# Altium project DMM6500 Scan card.PrjPcb
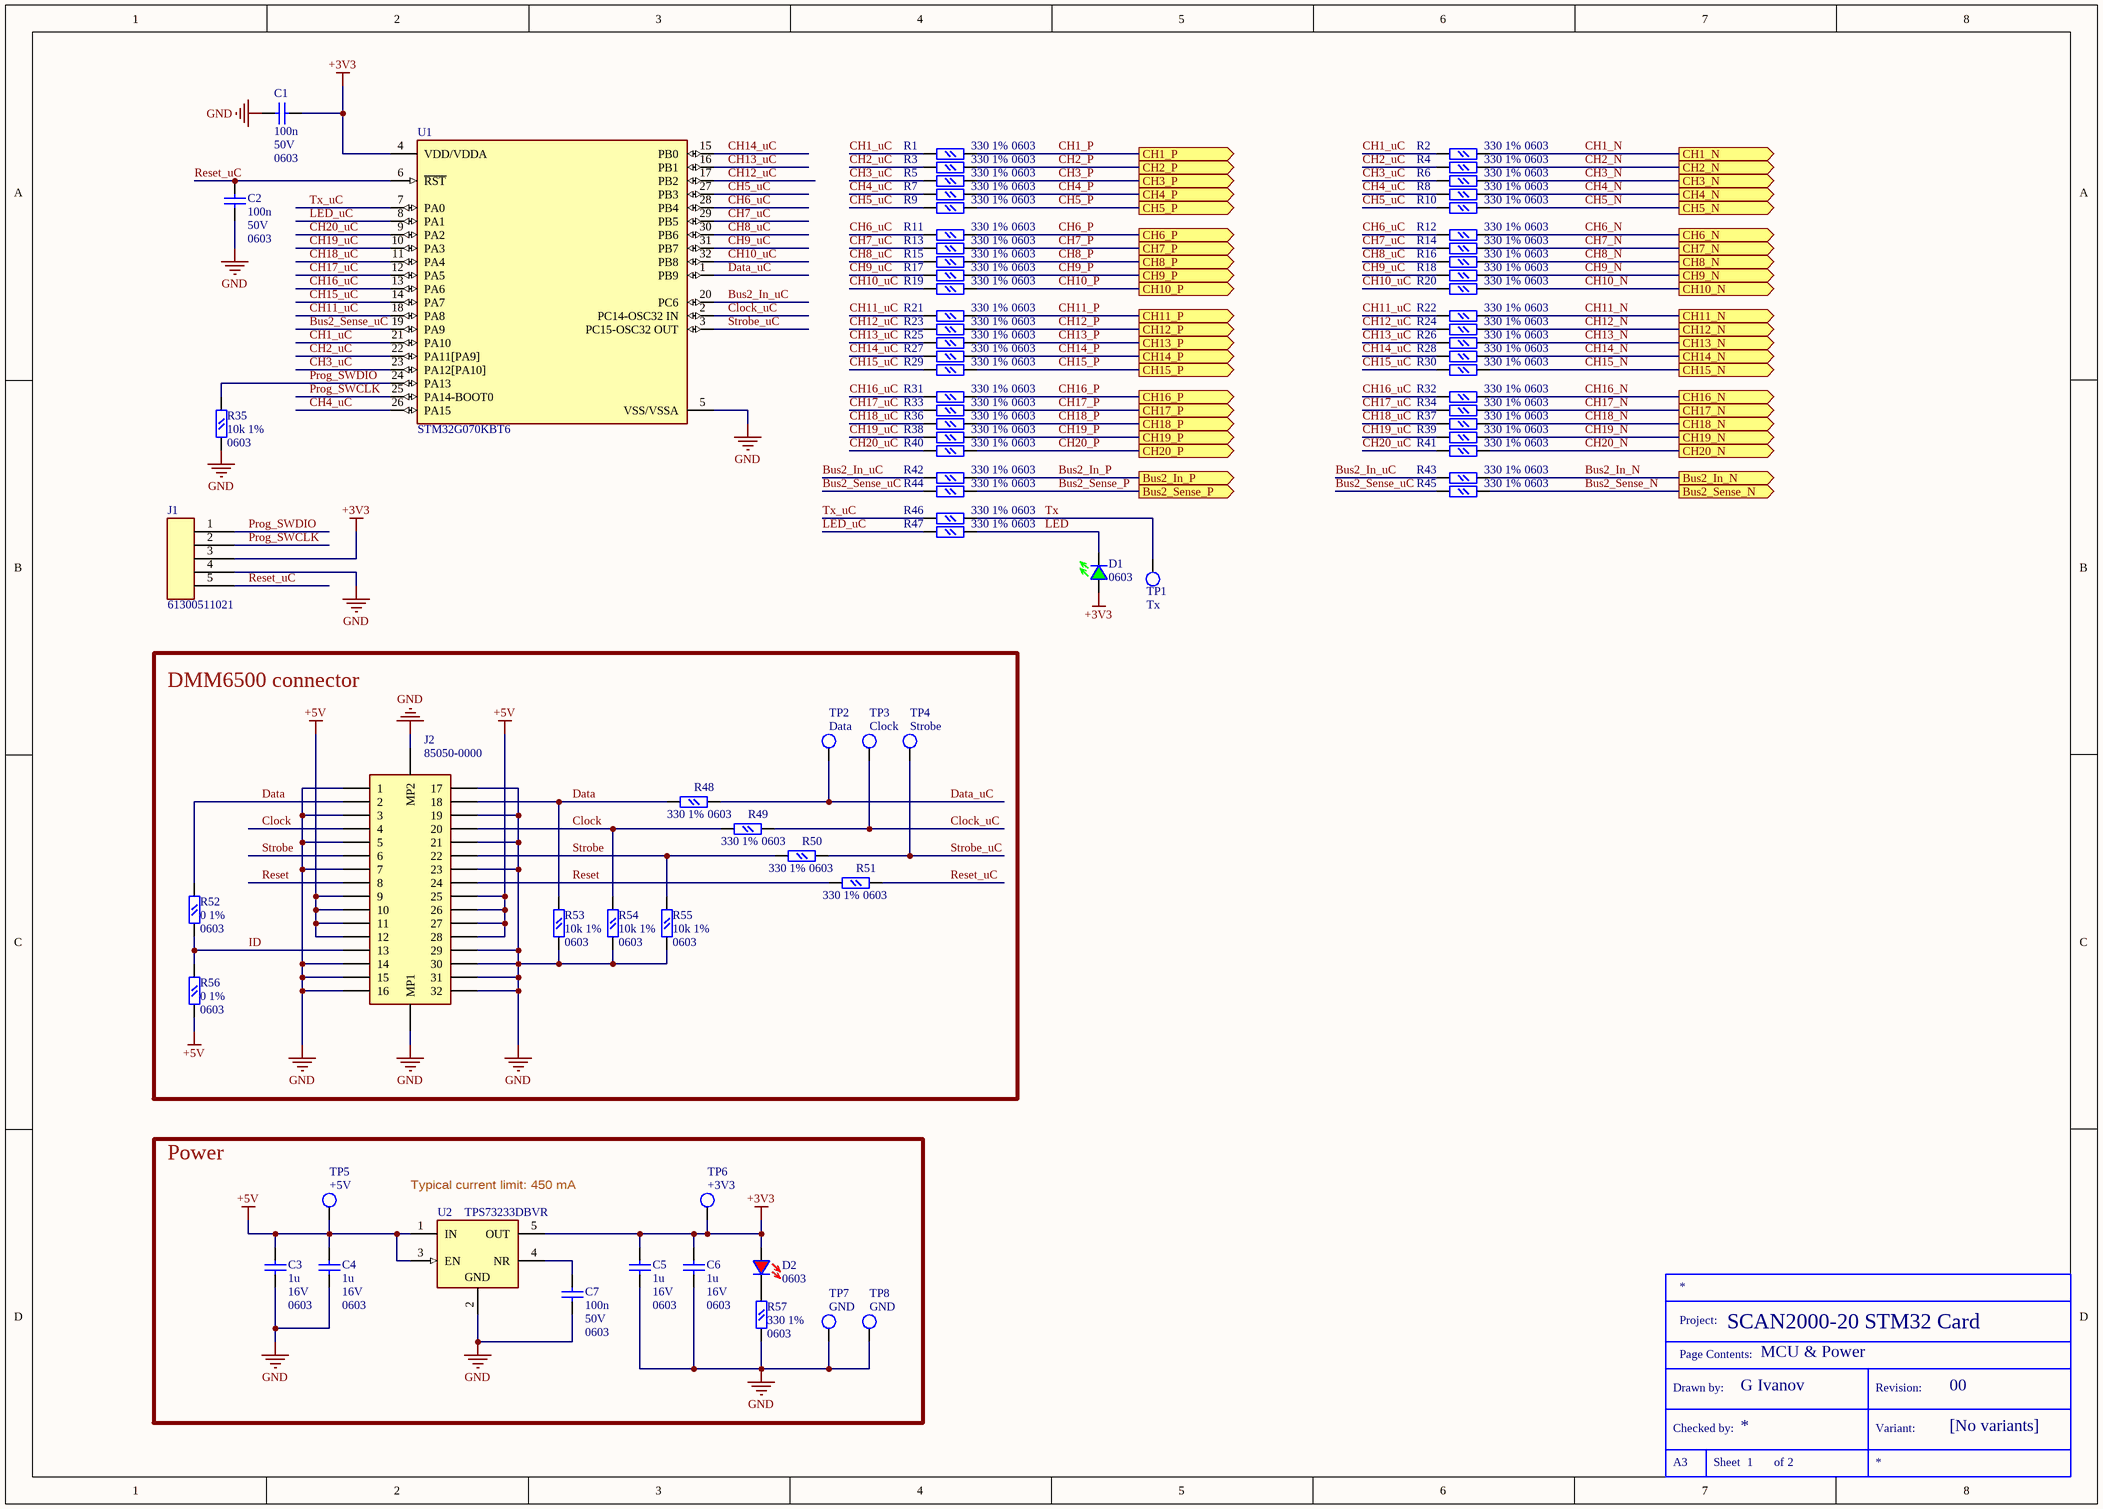
[diagram p0: Scan card MCU&Power.SchDoc]
2 sheets, 166 parts. Net scope: flat (ports and power ports of the same name join across sheets).
Board files: PCB1.PcbDoc, CAMtastic1.PcbDoc, DMM6500 Scan card.PcbDoc
Sheets:
  Scan card MCU&Power.SchDoc
  Scan card SSR.SchDoc

## Sheet Scan card MCU&Power.SchDoc: MCU & Power
size A3; DrawnBy: G Ivanov; Revision: 00; SheetNumber: 1; SheetTotal: 2; ProjectTitle: SCAN2000-20 STM32 Card; Variant: [No variants]; SheetSize: A3; SPICEModelCacheGEYJKKNZ: <root> / <DocumentId>GEYJKKNZ</DocumentId> / </root>

### Parts
(Parts that share a designator on the sheet are numbered #1, #2 ... from top to bottom, then left to right.)
C1  100n  Voltage: 50V  Package (imperial): 0603  [CAPC1608X08N]
C2  100n  Voltage: 50V  Package (imperial): 0603  [CAPC1608X08N]
C3  1u  Voltage: 16V  Package (imperial): 0603  [CAPC1608X08N]
C4  1u  Voltage: 16V  Package (imperial): 0603  [CAPC1608X08N]
C5  1u  Voltage: 16V  Package (imperial): 0603  [CAPC1608X08N]
C6  1u  Voltage: 16V  Package (imperial): 0603  [CAPC1608X08N]
C7  100n  Voltage: 50V  Package (imperial): 0603  [CAPC1608X08N]
D1  0603  [LED0603green]
D2  0603  [LED0603red]
J1  61300511021  [WE 61300511021]
J2  85050-0000  [Molex 85050-0000]
R1  330 1%  Package (imperial): 0603  [RESC1608X06N]
R2  330 1%  Package (imperial): 0603  [RESC1608X06N]
R3  330 1%  Package (imperial): 0603  [RESC1608X06N]
R4  330 1%  Package (imperial): 0603  [RESC1608X06N]
R5  330 1%  Package (imperial): 0603  [RESC1608X06N]
R6  330 1%  Package (imperial): 0603  [RESC1608X06N]
R7  330 1%  Package (imperial): 0603  [RESC1608X06N]
R8  330 1%  Package (imperial): 0603  [RESC1608X06N]
R9  330 1%  Package (imperial): 0603  [RESC1608X06N]
R10  330 1%  Package (imperial): 0603  [RESC1608X06N]
R11  330 1%  Package (imperial): 0603  [RESC1608X06N]
R12  330 1%  Package (imperial): 0603  [RESC1608X06N]
R13  330 1%  Package (imperial): 0603  [RESC1608X06N]
R14  330 1%  Package (imperial): 0603  [RESC1608X06N]
R15  330 1%  Package (imperial): 0603  [RESC1608X06N]
R16  330 1%  Package (imperial): 0603  [RESC1608X06N]
R17  330 1%  Package (imperial): 0603  [RESC1608X06N]
R18  330 1%  Package (imperial): 0603  [RESC1608X06N]
R19  330 1%  Package (imperial): 0603  [RESC1608X06N]
R20  330 1%  Package (imperial): 0603  [RESC1608X06N]
R21  330 1%  Package (imperial): 0603  [RESC1608X06N]
R22  330 1%  Package (imperial): 0603  [RESC1608X06N]
R23  330 1%  Package (imperial): 0603  [RESC1608X06N]
R24  330 1%  Package (imperial): 0603  [RESC1608X06N]
R25  330 1%  Package (imperial): 0603  [RESC1608X06N]
R26  330 1%  Package (imperial): 0603  [RESC1608X06N]
R27  330 1%  Package (imperial): 0603  [RESC1608X06N]
R28  330 1%  Package (imperial): 0603  [RESC1608X06N]
R29  330 1%  Package (imperial): 0603  [RESC1608X06N]
R30  330 1%  Package (imperial): 0603  [RESC1608X06N]
R31  330 1%  Package (imperial): 0603  [RESC1608X06N]
R32  330 1%  Package (imperial): 0603  [RESC1608X06N]
R33  330 1%  Package (imperial): 0603  [RESC1608X06N]
R34  330 1%  Package (imperial): 0603  [RESC1608X06N]
R35  10k 1%  Package (imperial): 0603  [RESC1608X06N]
R36  330 1%  Package (imperial): 0603  [RESC1608X06N]
R37  330 1%  Package (imperial): 0603  [RESC1608X06N]
R38  330 1%  Package (imperial): 0603  [RESC1608X06N]
R39  330 1%  Package (imperial): 0603  [RESC1608X06N]
R40  330 1%  Package (imperial): 0603  [RESC1608X06N]
R41  330 1%  Package (imperial): 0603  [RESC1608X06N]
R42  330 1%  Package (imperial): 0603  [RESC1608X06N]
R43  330 1%  Package (imperial): 0603  [RESC1608X06N]
R44  330 1%  Package (imperial): 0603  [RESC1608X06N]
R45  330 1%  Package (imperial): 0603  [RESC1608X06N]
R46  330 1%  Package (imperial): 0603  [RESC1608X06N]
R47  330 1%  Package (imperial): 0603  [RESC1608X06N]
R48  330 1%  Package (imperial): 0603  [RESC1608X06N]
R49  330 1%  Package (imperial): 0603  [RESC1608X06N]
R50  330 1%  Package (imperial): 0603  [RESC1608X06N]
R51  330 1%  Package (imperial): 0603  [RESC1608X06N]
R52  0 1%  Package (imperial): 0603  [RESC1608X06N]
R53  10k 1%  Package (imperial): 0603  [RESC1608X06N]
R54  10k 1%  Package (imperial): 0603  [RESC1608X06N]
R55  10k 1%  Package (imperial): 0603  [RESC1608X06N]
R56  0 1%  Package (imperial): 0603  [RESC1608X06N]
R57  330 1%  Package (imperial): 0603  [RESC1608X06N]
TBLOCK?#1  *  (value not drawn)  (graphical)
TP1  Tx  [TP_ROUND_20_10]
TP2  Data  [TP_ROUND_20_10]
TP3  Clock  [TP_ROUND_20_10]
TP4  Strobe  [TP_ROUND_20_10]
TP5  +5V  [TP_ROUND_20_10]
TP6  +3V3  [TP_ROUND_20_10]
TP7  GND  [TP_ROUND_20_10]
TP8  GND  [TP_ROUND_20_10]
U1  STM32G070KBT6  [LQFP80P900X900X160-32N]
U2  TPS73233DBVR  [SOT23-5-095_N]

### Blocks framed on the sheet
DMM6500 connector: J2 R48-R56 TP2-TP4
Power: C3-C7 D2 R57 TP5-TP8 U2

### Ports
Bus2_In_N (out), Bus2_In_P (out), Bus2_Sense_N (out), Bus2_Sense_P (out), CH1_N (out), CH1_P (out), CH2_N (out), CH2_P (out), CH3_N (out), CH3_P (out), CH4_N (out), CH4_P (out), CH5_N (out), CH5_P (out), CH6_N (out), CH6_P (out), CH7_N (out), CH7_P (out), CH8_N (out), CH8_P (out), CH9_N (out), CH9_P (out), CH10_N (out), CH10_P (out), CH11_N (out), CH11_P (out), CH12_N (out), CH12_P (out), CH13_N (out), CH13_P (out), CH14_N (out), CH14_P (out), CH15_N (out), CH15_P (out), CH16_N (out), CH16_P (out), CH17_N (out), CH17_P (out), CH18_N (out), CH18_P (out), CH19_N (out), CH19_P (out), CH20_N (out), CH20_P (out)

### Nets
+3V3: C1.1 C5.2 C6.2 D1.2(Anode) D2.2(Anode) J1.3 TP6.1 U1.4(VDD/VDDA) U2.5(OUT)
+5V: C3.2 C4.2 J2.A9(9) J2.A10(10) J2.A11(11) J2.A12(12) J2.B9(25) J2.B10(26) J2.B11(27) J2.B12(28) R56.1 TP5.1 U2.1(IN) U2.3(EN)
GND: C1.2 C2.1 C3.1 C4.1 C5.1 C6.1 C7.1 J1.4 J2.A1(1) J2.A3(3) J2.A5(5) J2.A7(7) J2.A14(14) J2.A15(15) J2.A16(16) J2.B1(17) J2.B3(19) J2.B5(21) J2.B7(23) J2.B13(29) J2.B14(30) J2.B15(31) J2.B16(32) J2.MP1 J2.MP2 R35.1 R53.1 R54.1 R55.1 R57.1 TP7.1 TP8.1 U1.5(VSS/VSSA) U2.2(GND)
Bus2_In_N: R43.2 ; port Bus2_In_N
Bus2_In_P: R42.2 ; port Bus2_In_P
Bus2_In_uC: R42.1 R43.1 U1.20(PC6)
Bus2_Sense_N: R45.2 ; port Bus2_Sense_N
Bus2_Sense_P: R44.2 ; port Bus2_Sense_P
Bus2_Sense_uC: R44.1 R45.1 U1.19(PA9)
CH1_N: R2.2 ; port CH1_N
CH1_P: R1.2 ; port CH1_P
CH1_uC: R1.1 R2.1 U1.21(PA10)
CH2_N: R4.2 ; port CH2_N
CH2_P: R3.2 ; port CH2_P
CH2_uC: R3.1 R4.1 U1.22(PA11[PA9])
CH3_N: R6.2 ; port CH3_N
CH3_P: R5.2 ; port CH3_P
CH3_uC: R5.1 R6.1 U1.23(PA12[PA10])
CH4_N: R8.2 ; port CH4_N
CH4_P: R7.2 ; port CH4_P
CH4_uC: R7.1 R8.1 U1.26(PA15)
CH5_N: R10.2 ; port CH5_N
CH5_P: R9.2 ; port CH5_P
CH5_uC: R9.1 R10.1 U1.27(PB3)
CH6_N: R12.2 ; port CH6_N
CH6_P: R11.2 ; port CH6_P
CH6_uC: R11.1 R12.1 U1.28(PB4)
CH7_N: R14.2 ; port CH7_N
CH7_P: R13.2 ; port CH7_P
CH7_uC: R13.1 R14.1 U1.29(PB5)
CH8_N: R16.2 ; port CH8_N
CH8_P: R15.2 ; port CH8_P
CH8_uC: R15.1 R16.1 U1.30(PB6)
CH9_N: R18.2 ; port CH9_N
CH9_P: R17.2 ; port CH9_P
CH9_uC: R17.1 R18.1 U1.31(PB7)
CH10_N: R20.2 ; port CH10_N
CH10_P: R19.2 ; port CH10_P
CH10_uC: R19.1 R20.1 U1.32(PB8)
CH11_N: R22.2 ; port CH11_N
CH11_P: R21.2 ; port CH11_P
CH11_uC: R21.1 R22.1 U1.18(PA8)
CH12_N: R24.2 ; port CH12_N
CH12_P: R23.2 ; port CH12_P
CH12_uC: R23.1 R24.1 U1.17(PB2)
CH13_N: R26.2 ; port CH13_N
CH13_P: R25.2 ; port CH13_P
CH13_uC: R25.1 R26.1 U1.16(PB1)
CH14_N: R28.2 ; port CH14_N
CH14_P: R27.2 ; port CH14_P
CH14_uC: R27.1 R28.1 U1.15(PB0)
CH15_N: R30.2 ; port CH15_N
CH15_P: R29.2 ; port CH15_P
CH15_uC: R29.1 R30.1 U1.14(PA7)
CH16_N: R32.2 ; port CH16_N
CH16_P: R31.2 ; port CH16_P
CH16_uC: R31.1 R32.1 U1.13(PA6)
CH17_N: R34.2 ; port CH17_N
CH17_P: R33.2 ; port CH17_P
CH17_uC: R33.1 R34.1 U1.12(PA5)
CH18_N: R37.2 ; port CH18_N
CH18_P: R36.2 ; port CH18_P
CH18_uC: R36.1 R37.1 U1.11(PA4)
CH19_N: R39.2 ; port CH19_N
CH19_P: R38.2 ; port CH19_P
CH19_uC: R38.1 R39.1 U1.10(PA3)
CH20_N: R41.2 ; port CH20_N
CH20_P: R40.2 ; port CH20_P
CH20_uC: R40.1 R41.1 U1.9(PA2)
Clock: J2.A4(4) J2.B4(20) R49.1 R54.2
Clock_uC: R49.2 TP3.1 U1.2(PC14-OSC32_IN)
Data: J2.A2(2) J2.B2(18) R48.1 R52.2 R53.2
Data_uC: R48.2 TP2.1 U1.1(PB9)
ID: J2.A13(13) R52.1 R56.2
LED: D1.1(Cathode) R47.2
LED_uC: R47.1 U1.8(PA1)
Prog_SWCLK: J1.2 U1.25(PA14-BOOT0)
Prog_SWDIO: J1.1 R35.2 U1.24(PA13)
Reset: J2.A8(8) J2.B8(24) R51.1
Reset_uC: C2.2 J1.5 R51.2 U1.6(~{RST})
Strobe: J2.A6(6) J2.B6(22) R50.1 R55.2
Strobe_uC: R50.2 TP4.1 U1.3(PC15-OSC32_OUT)
Tx: R46.2 TP1.1
Tx_uC: R46.1 U1.7(PA0)
NetC7_2: C7.2 U2.4(NR)
NetD2_1: D2.1(Cathode) R57.2

### Notes on the sheet
- (near U2) Typical current limit: 450 mA
- (in symbol TitleBlockStandard) Project:; Page Contents:; Drawn by:; Revision:; Checked by:; Variant:; Sheet; of

### Library data of the parts
C1 C2 C7 = CC0603KRX7R9BB104: Multilayer Ceramic Capacitor, CC Series, 0.1 - F, - 10%, X7R, 50 V, 0603 [1608 Metric]; Manufacturer: Yageo; Accuracy: 0.1; Package (metric): 1608; Part Number: CC0603KRX7R9BB104; Height: 0.8mm; Capacitance: 100n; Material: X7R; Pin Count: 2; ComponentLink1Description: Datasheet; ComponentLink1URL: Datasheets\Capacitors\Yageo X7R.pdf
C3-C6 = CC0603KRX7R7BB105: 0603 1 uF 16 V ±10 % Tolerance X7R SMT Multilayer Ceramic Capacitor; Manufacturer: Yageo; Accuracy: 0.1; Package (metric): 1608; Part Number: CC0603KRX7R7BB105; Height: 0.8mm; Capacitance: 1u; Material: X7R; Pin Count: 3; ComponentLink1Description: Datasheet; ComponentLink1URL: Datasheets\Capacitors\Yageo X7R.pdf
D1 = LED0603green: Generic LED green 0603; Package (metric): 1608; Part Number: LED0603green; Color: green; Package (imperial): 0603
D2 = LED0603red: Generic LED red 0603; Package (metric): 1608; Part Number: LED0603red; Color: red; Package (imperial): 0603
J1 = 61300511021: single row, 5p; Manufacturer: Wurth Elektronik; Desctiption: Pin Header, pitch 2.54 mm, THT, Angled, single row, 5p; Part Number: 61300511021; Pin Count: 5; ComponentLink1Description: Datasheet; ComponentLink1URL: https://www.we-online.com/catalog/en/PHD_2_54_THT_ANGLED_PIN_HEADER_6130XX11021; ComponentLink2Description: Drawing; ComponentLink2URL: Datasheets\Connectors\WE\61300511021_drawing.pdf
J2 = 85050-0000: 32 pos. female connector DIN41612 style Q/2 + clip; Manufacturer: Molex; Desctiption: 2.54mm Pitch DIN 41612 Receptacle, Style Q/2 Reverse, 32 Circuits; Part Number: 85050-0000; Pin Count: 32; ComponentLink1Description: Datasheet; ComponentLink1URL: Datasheets\Connectors\Molex\850500000_datasheet.pdf; ComponentLink2Description: Drawing; ComponentLink2URL: Datasheets\Connectors\Molex\850500000_drawing.pdf; ComponentLink3Description: 3D Model; ComponentLink3URL: 3D Models\Connectors\Molex\850500000.stp
R1-R34 R36-R51 R57 = RC0603FR-07330RL: YAGEO (PHYCOMP) - RC0603FR-07330RL - RES, THICK FILM, 330R, 1%, 0.1W, 0603; Resistance: 330; Power: 100mW; Package (metric): 1608; Part Number: RC0603FR-07330RL; Manufacturer: Yageo; Height: 0.45mm; Accuracy: 1%; Pin Count: 2; ComponentLink1Description: Datasheet; ComponentLink1URL: Datasheets\Resistors\Yageo 0603.pdf
R35 R53-R55 = RC0603FR-0710KL: 100mW 75V ±100ppm/℃ ±1% -55℃~+155℃ 10kΩ 0603 Chip Resistor - Surface Mount ROHS; Manufacturer: Yageo; Package (metric): 1608; Part Number: RC0603FR-0710KL; Height: 0.45mm; Resistance: 10k; Power: 100mW; Accuracy: 1%; Pin Count: 2; ComponentLink1Description: Datasheet; ComponentLink1URL: Datasheets\Resistors\Yageo 0603.pdf
R52 R56 = RC0603FR-070RL: RC Series 0603 0.1 W 0 Ohm Jumper Surface Mount Thick Film Chip Resistor; Manufacturer: Yageo; Resistance: 0; Power: 100mW; Package (metric): 1608; Part Number: RC0603FR-070RL; Height: 0.45mm; Accuracy: 1%; Pin Count: 3; ComponentLink1Description: Datasheet; ComponentLink1URL: Datasheets\Resistors\Yageo 0603.pdf
TBLOCK?#1 = TitleBlockStandard: Designator: TBLOCK?; Part Number: TitleBlockStandard
TP1-TP8 = TP_ROUND_20_10: Test point, round pad, 1 mm hole, 2 mm dia; Part Number: TP_ROUND_20_10
U1 = STM32G070KBT6: Arm® Cortex®-M0+ 32-bit MCU, 128 KB Flash, 36 KB RAM,  4x USART, timers, ADC, comm. I/Fs, 2.0-3.6V; Manufacturer: STM; Number Of Timers/Counters: 11; Ram Size: 36KBytes; Memory Size: 128KBytes; Number Of Cores: 1; Core Architecture: ARM Cortex-M0+; Number Of Spi Channels: 2; Data Bus Width: 32bits; Max Supply Voltage: 3.6V; Standoff Height: 0.05mm; Max Junction Temp: +105°C; Nominal Supply Current: 0.3-6.9mA; Frequency: 64MHz; Number Of Adc Channels: 13; Number Of I/Os: 29; Min Supply Voltage: 2V; Interface: I2C,SPI,UART,USART,LIN,IrDA,I2S,SMBus,Other; Number Of Uart Channels: 4; Operating Frequency(F) (Processor speed) (MHz): 64; FLASH Size (Prog) (kB): 128; Internal RAM Size (kB): 36; Memory Type: FLASH; Ambient Temperature Range High: +85°C; Automotive: No; Octopart: https://octopart.com/stm32g070kbt6-stmicroelectronics-97300430; Temperature: -40°C to +85°C; Temperature Range Low: -40°C; Package: LQFP32-5V; Manufacturer Part Number: STM32G070KBT6; Number Of I2C Channels: 2; Height: 1.6mm; Device Class L3: Microcontrollers; ComponentLink2URL: https://www.st.com/resource/en/reference_manual/rm0454-stm32g0x0-advanced-armbased-32bit-mcus-stmicroelectronics.pdf; Device Class L2: Embedded Processors and Controllers; ComponentLink2Description: Datasheet; Number Of A/D Converters: 1; Temperature Range High: +85°C; Ambient Temperature Range Low: -40°C; Category: IC; Lead Free: Yes; Ipc Land Pattern Name: QFP80P900X900X160-32; Mouser Description: Cortex M0 128K LQFP32 85°C; RoHS: TRUE; Device Class L1: Integrated Circuits (ICs); Digikey Description: MAINSTREAM VALUE LINE, ARM CORTE; Part Number: STM32G070KBT6; ComponentLink1Description: Package Specification; ComponentLink1URL: https://www.st.com/resource/en/datasheet/stm32g070kb.pdf; ComponentLink3Description: Manufacturer URL; ComponentLink3URL: https://www.st.com/en/microcontrollers-microprocessors/stm32g070kb.html#documentation; PackageDescription: 32-Pin Low Profile Quad Flat Package, 7 x 7 mm Body, 0.8 mm Pitch; PackageReference: LQFP32; Supply Voltage(Vcc) min (V): 2; Mounting Technology: Surface Mount; I/Os (High Current): 29; Core: ARM Cortex-M0+
U2 = TPS73233DBVR: Single Output Fast Transient Response LDO, 200 mA, Fixed 3.3 V Output, 1.7 to 5.5 V Input, with Reverse Current Protection, 5-pin SOT-23 (DBV), -40 to 85 degC, Green (RoHS & no Sb/Br); Manufacturer: Texas Instruments; Vin(Max)(V): 5.5; Vin(Min)(V): 1.7; Vout Adj(Min)(V): 3.3; Accuracy(%): 1; Iout(Max)(A): 0.25; SubFamily: Single Channel LDO; Iq(Typ)(mA): 0.4; Vdo(Typ)(mV): 40; ComponentLink2Description: Datasheet; DatasheetVersion: SBVS037O; PartNumber: TPS73233DBVR; ComponentLink1Description: Datasheet; PackageVersion: 4073253-4/K; Code_JEDEC: MO-178; ComponentLink1URL: Datasheets\LDO Regulators\tps732.pdf; ComponentLink3Description: Package Specification; Eco-Plan: Green (RoHS & no Sb/Br); PackageDescription: 5-Pin Plastic Small Outline, Body 1.60 Ãƒâ€” 2.90 mm, Pitch 0.95 mm; Fixed Output Options(V): 3.3; ComponentLink3URL: http://www.ti.com/litv/pdf/mpds018i; Vout Adj(Max)(V): 3.3; ComponentLink2URL: http://www.ti.com/general/docs/lit/getliterature.tsp?genericPartNumber=TPS73233&fileType=pdf; PackageReference: DBV0005A; Mounting Technology: Surface Mount; Part Number: TPS73233DBVR; Pin Count: 5

## Sheet Scan card SSR.SchDoc: Solid State Relays
size A3; DrawnBy: G Ivanov; Revision: 00; SheetNumber: 2; SheetTotal: 2; ProjectTitle: SCAN2000-20 STM32 Card; Variant: [No variants]; SheetSize: A3
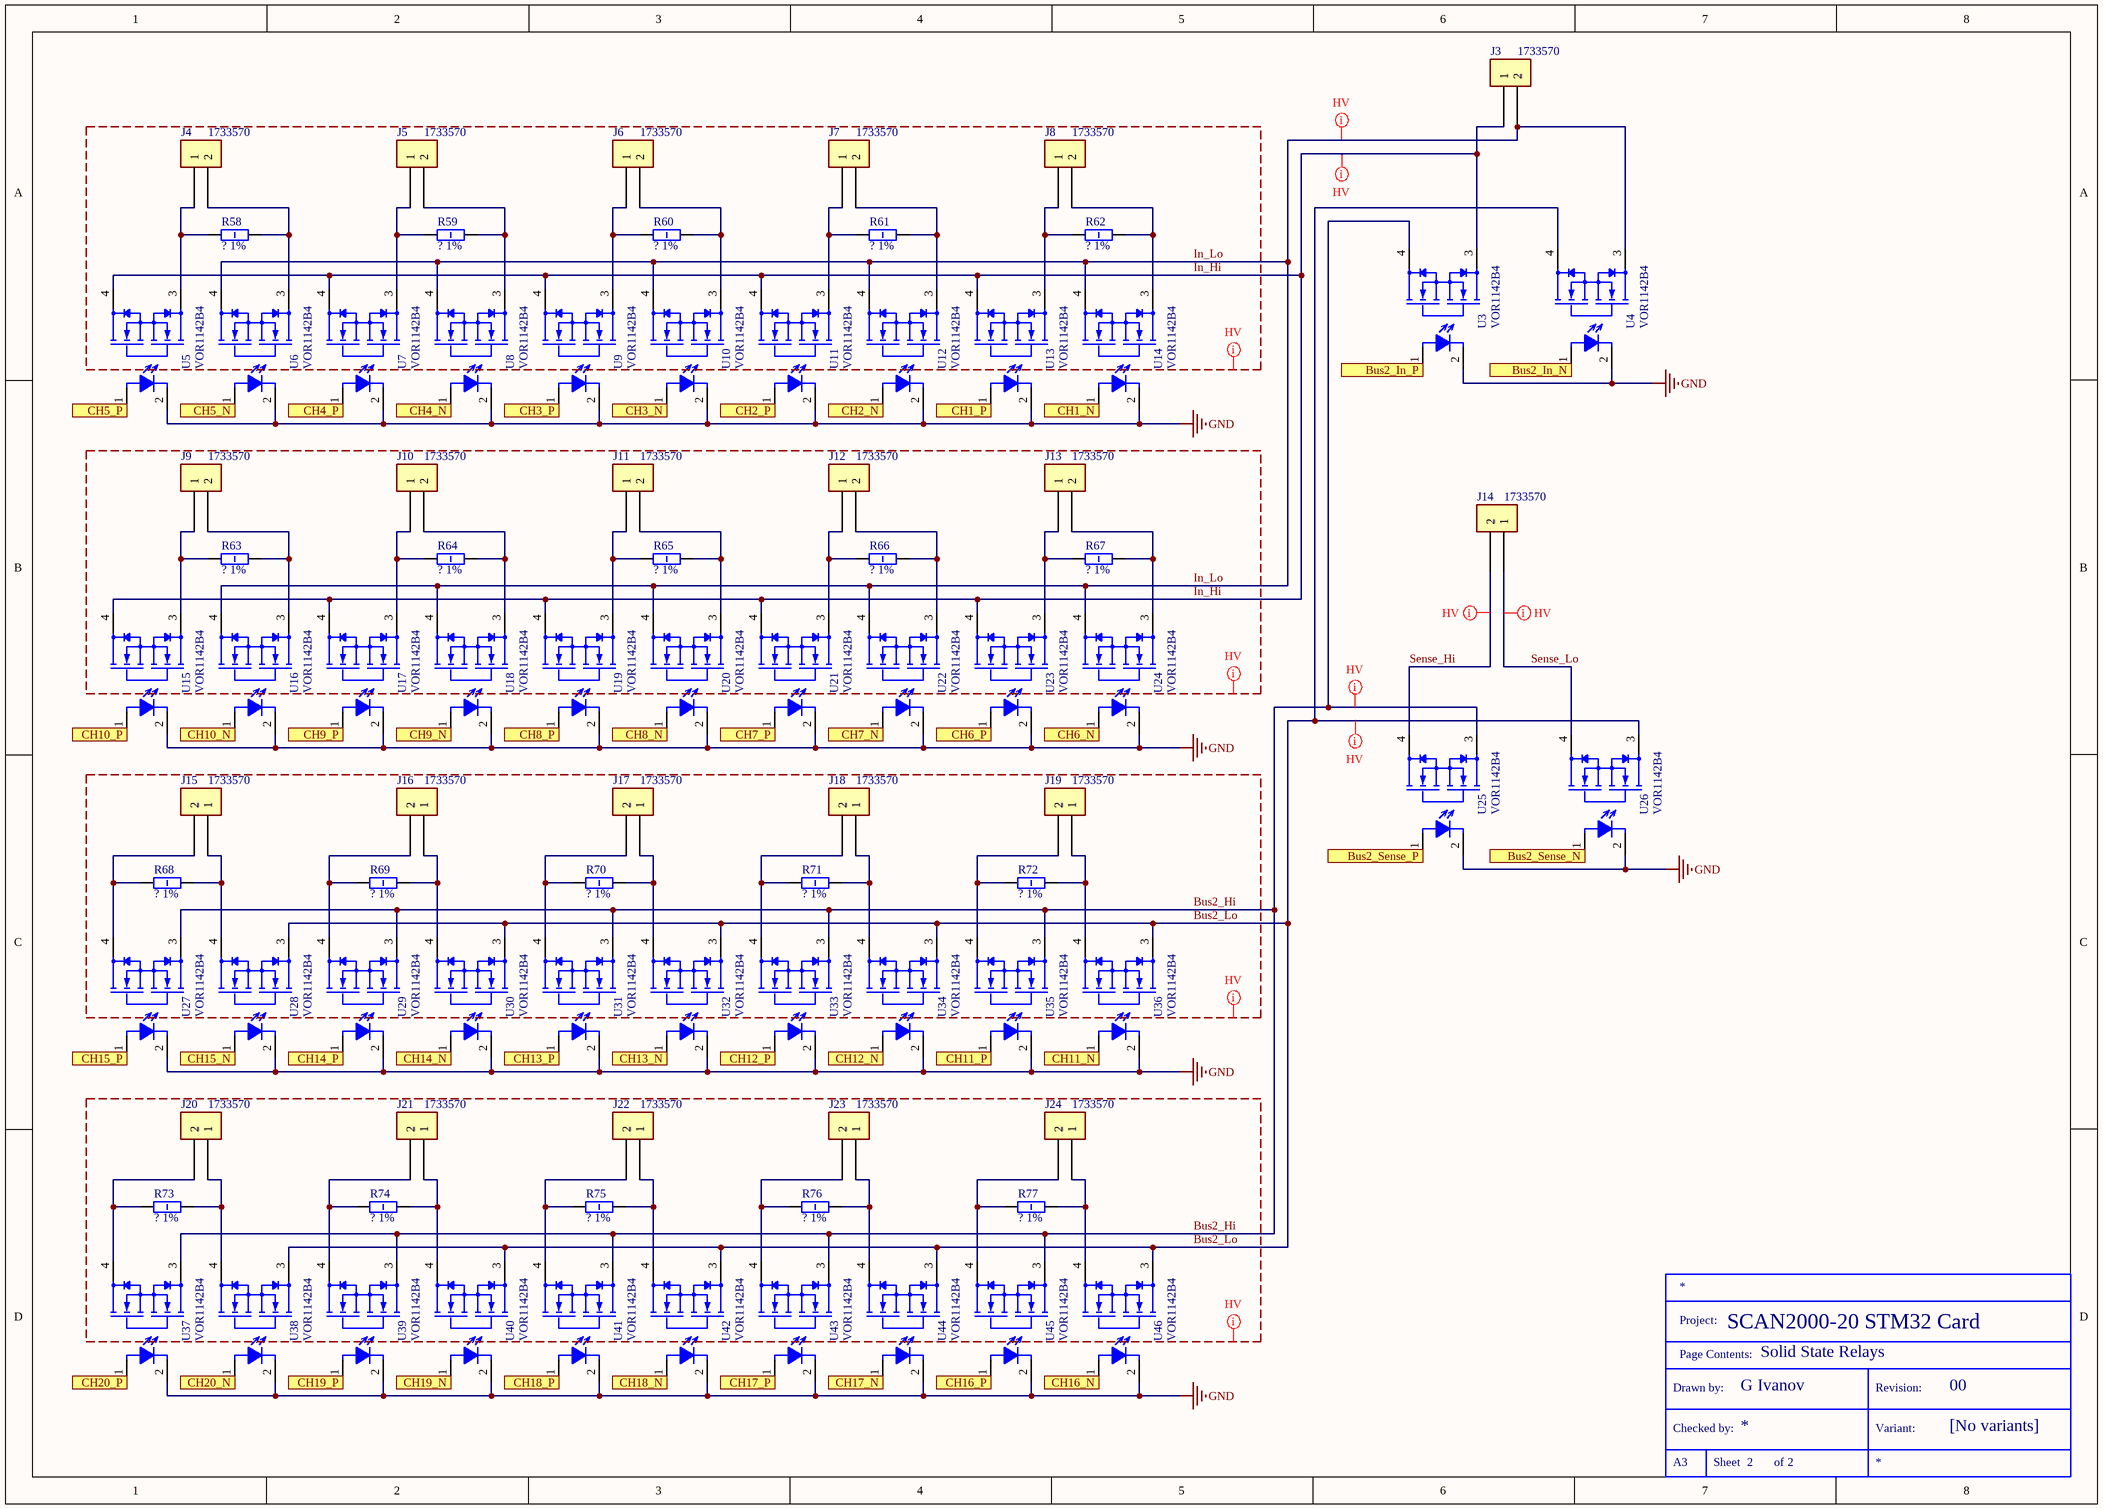
[diagram p1: Scan card SSR.SchDoc]

### Parts
(Parts that share a designator on the sheet are numbered #1, #2 ... from top to bottom, then left to right.)
J3  1733570  [Phoenix Contact 1733570]
J4  1733570  [Phoenix Contact 1733570]
J5  1733570  [Phoenix Contact 1733570]
J6  1733570  [Phoenix Contact 1733570]
J7  1733570  [Phoenix Contact 1733570]
J8  1733570  [Phoenix Contact 1733570]
J9  1733570  [Phoenix Contact 1733570]
J10  1733570  [Phoenix Contact 1733570]
J11  1733570  [Phoenix Contact 1733570]
J12  1733570  [Phoenix Contact 1733570]
J13  1733570  [Phoenix Contact 1733570]
J14  1733570  [Phoenix Contact 1733570]
J15  1733570  [Phoenix Contact 1733570]
J16  1733570  [Phoenix Contact 1733570]
J17  1733570  [Phoenix Contact 1733570]
J18  1733570  [Phoenix Contact 1733570]
J19  1733570  [Phoenix Contact 1733570]
J20  1733570  [Phoenix Contact 1733570]
J21  1733570  [Phoenix Contact 1733570]
J22  1733570  [Phoenix Contact 1733570]
J23  1733570  [Phoenix Contact 1733570]
J24  1733570  [Phoenix Contact 1733570]
R58  ? 1%  [RESC6431X06N]
R59  ? 1%  [RESC6431X06N]
R60  ? 1%  [RESC6431X06N]
R61  ? 1%  [RESC6431X06N]
R62  ? 1%  [RESC6431X06N]
R63  ? 1%  [RESC6431X06N]
R64  ? 1%  [RESC6431X06N]
R65  ? 1%  [RESC6431X06N]
R66  ? 1%  [RESC6431X06N]
R67  ? 1%  [RESC6431X06N]
R68  ? 1%  [RESC6431X06N]
R69  ? 1%  [RESC6431X06N]
R70  ? 1%  [RESC6431X06N]
R71  ? 1%  [RESC6431X06N]
R72  ? 1%  [RESC6431X06N]
R73  ? 1%  [RESC6431X06N]
R74  ? 1%  [RESC6431X06N]
R75  ? 1%  [RESC6431X06N]
R76  ? 1%  [RESC6431X06N]
R77  ? 1%  [RESC6431X06N]
TBLOCK?#2  *  (value not drawn)  (graphical)
U3  VOR1142B4  [SOP254P1000X380-4N]
U4  VOR1142B4  [SOP254P1000X380-4N]
U5  VOR1142B4  [SOP254P1000X380-4N]
U6  VOR1142B4  [SOP254P1000X380-4N]
U7  VOR1142B4  [SOP254P1000X380-4N]
U8  VOR1142B4  [SOP254P1000X380-4N]
U9  VOR1142B4  [SOP254P1000X380-4N]
U10  VOR1142B4  [SOP254P1000X380-4N]
U11  VOR1142B4  [SOP254P1000X380-4N]
U12  VOR1142B4  [SOP254P1000X380-4N]
U13  VOR1142B4  [SOP254P1000X380-4N]
U14  VOR1142B4  [SOP254P1000X380-4N]
U15  VOR1142B4  [SOP254P1000X380-4N]
U16  VOR1142B4  [SOP254P1000X380-4N]
U17  VOR1142B4  [SOP254P1000X380-4N]
U18  VOR1142B4  [SOP254P1000X380-4N]
U19  VOR1142B4  [SOP254P1000X380-4N]
U20  VOR1142B4  [SOP254P1000X380-4N]
U21  VOR1142B4  [SOP254P1000X380-4N]
U22  VOR1142B4  [SOP254P1000X380-4N]
U23  VOR1142B4  [SOP254P1000X380-4N]
U24  VOR1142B4  [SOP254P1000X380-4N]
U25  VOR1142B4  [SOP254P1000X380-4N]
U26  VOR1142B4  [SOP254P1000X380-4N]
U27  VOR1142B4  [SOP254P1000X380-4N]
U28  VOR1142B4  [SOP254P1000X380-4N]
U29  VOR1142B4  [SOP254P1000X380-4N]
U30  VOR1142B4  [SOP254P1000X380-4N]
U31  VOR1142B4  [SOP254P1000X380-4N]
U32  VOR1142B4  [SOP254P1000X380-4N]
U33  VOR1142B4  [SOP254P1000X380-4N]
U34  VOR1142B4  [SOP254P1000X380-4N]
U35  VOR1142B4  [SOP254P1000X380-4N]
U36  VOR1142B4  [SOP254P1000X380-4N]
U37  VOR1142B4  [SOP254P1000X380-4N]
U38  VOR1142B4  [SOP254P1000X380-4N]
U39  VOR1142B4  [SOP254P1000X380-4N]
U40  VOR1142B4  [SOP254P1000X380-4N]
U41  VOR1142B4  [SOP254P1000X380-4N]
U42  VOR1142B4  [SOP254P1000X380-4N]
U43  VOR1142B4  [SOP254P1000X380-4N]
U44  VOR1142B4  [SOP254P1000X380-4N]
U45  VOR1142B4  [SOP254P1000X380-4N]
U46  VOR1142B4  [SOP254P1000X380-4N]

### Ports
Bus2_In_N (in), Bus2_In_P (in), Bus2_Sense_N (in), Bus2_Sense_P (in), CH1_N (in), CH1_P (in), CH2_N (in), CH2_P (in), CH3_N (in), CH3_P (in), CH4_N (in), CH4_P (in), CH5_N (in), CH5_P (in), CH6_N (in), CH6_P (in), CH7_N (in), CH7_P (in), CH8_N (in), CH8_P (in), CH9_N (in), CH9_P (in), CH10_N (in), CH10_P (in), CH11_N (in), CH11_P (in), CH12_N (in), CH12_P (in), CH13_N (in), CH13_P (in), CH14_N (in), CH14_P (in), CH15_N (in), CH15_P (in), CH16_N (in), CH16_P (in), CH17_N (in), CH17_P (in), CH18_N (in), CH18_P (in), CH19_N (in), CH19_P (in), CH20_N (in), CH20_P (in)

### Nets
GND: U3.2(-Control) U4.2(-Control) U5.2(-Control) U6.2(-Control) U7.2(-Control) U8.2(-Control) U9.2(-Control) U10.2(-Control) U11.2(-Control) U12.2(-Control) U13.2(-Control) U14.2(-Control) U15.2(-Control) U16.2(-Control) U17.2(-Control) U18.2(-Control) U19.2(-Control) U20.2(-Control) U21.2(-Control) U22.2(-Control) U23.2(-Control) U24.2(-Control) U25.2(-Control) U26.2(-Control) U27.2(-Control) U28.2(-Control) U29.2(-Control) U30.2(-Control) U31.2(-Control) U32.2(-Control) U33.2(-Control) U34.2(-Control) U35.2(-Control) U36.2(-Control) U37.2(-Control) U38.2(-Control) U39.2(-Control) U40.2(-Control) U41.2(-Control) U42.2(-Control) U43.2(-Control) U44.2(-Control) U45.2(-Control) U46.2(-Control)
Bus2_Hi: U3.4(2_LOAD) U25.3(1_LOAD) U27.3(1_LOAD) U29.3(1_LOAD) U31.3(1_LOAD) U33.3(1_LOAD) U35.3(1_LOAD) U37.3(1_LOAD) U39.3(1_LOAD) U41.3(1_LOAD) U43.3(1_LOAD) U45.3(1_LOAD)
Bus2_In_N: U4.1(+Control) ; port Bus2_In_N
Bus2_In_P: U3.1(+Control) ; port Bus2_In_P
Bus2_Lo: U4.4(2_LOAD) U26.3(1_LOAD) U28.3(1_LOAD) U30.3(1_LOAD) U32.3(1_LOAD) U34.3(1_LOAD) U36.3(1_LOAD) U38.3(1_LOAD) U40.3(1_LOAD) U42.3(1_LOAD) U44.3(1_LOAD) U46.3(1_LOAD)
Bus2_Sense_N: U26.1(+Control) ; port Bus2_Sense_N
Bus2_Sense_P: U25.1(+Control) ; port Bus2_Sense_P
CH1_N: U14.1(+Control) ; port CH1_N
CH1_P: U13.1(+Control) ; port CH1_P
CH2_N: U12.1(+Control) ; port CH2_N
CH2_P: U11.1(+Control) ; port CH2_P
CH3_N: U10.1(+Control) ; port CH3_N
CH3_P: U9.1(+Control) ; port CH3_P
CH4_N: U8.1(+Control) ; port CH4_N
CH4_P: U7.1(+Control) ; port CH4_P
CH5_N: U6.1(+Control) ; port CH5_N
CH5_P: U5.1(+Control) ; port CH5_P
CH6_N: U24.1(+Control) ; port CH6_N
CH6_P: U23.1(+Control) ; port CH6_P
CH7_N: U22.1(+Control) ; port CH7_N
CH7_P: U21.1(+Control) ; port CH7_P
CH8_N: U20.1(+Control) ; port CH8_N
CH8_P: U19.1(+Control) ; port CH8_P
CH9_N: U18.1(+Control) ; port CH9_N
CH9_P: U17.1(+Control) ; port CH9_P
CH10_N: U16.1(+Control) ; port CH10_N
CH10_P: U15.1(+Control) ; port CH10_P
CH11_N: U36.1(+Control) ; port CH11_N
CH11_P: U35.1(+Control) ; port CH11_P
CH12_N: U34.1(+Control) ; port CH12_N
CH12_P: U33.1(+Control) ; port CH12_P
CH13_N: U32.1(+Control) ; port CH13_N
CH13_P: U31.1(+Control) ; port CH13_P
CH14_N: U30.1(+Control) ; port CH14_N
CH14_P: U29.1(+Control) ; port CH14_P
CH15_N: U28.1(+Control) ; port CH15_N
CH15_P: U27.1(+Control) ; port CH15_P
CH16_N: U46.1(+Control) ; port CH16_N
CH16_P: U45.1(+Control) ; port CH16_P
CH17_N: U44.1(+Control) ; port CH17_N
CH17_P: U43.1(+Control) ; port CH17_P
CH18_N: U42.1(+Control) ; port CH18_N
CH18_P: U41.1(+Control) ; port CH18_P
CH19_N: U40.1(+Control) ; port CH19_N
CH19_P: U39.1(+Control) ; port CH19_P
CH20_N: U38.1(+Control) ; port CH20_N
CH20_P: U37.1(+Control) ; port CH20_P
In_Hi: J3.1 U3.3(1_LOAD) U5.4(2_LOAD) U7.4(2_LOAD) U9.4(2_LOAD) U11.4(2_LOAD) U13.4(2_LOAD) U15.4(2_LOAD) U17.4(2_LOAD) U19.4(2_LOAD) U21.4(2_LOAD) U23.4(2_LOAD)
In_Lo: J3.2 U4.3(1_LOAD) U6.4(2_LOAD) U8.4(2_LOAD) U10.4(2_LOAD) U12.4(2_LOAD) U14.4(2_LOAD) U16.4(2_LOAD) U18.4(2_LOAD) U20.4(2_LOAD) U22.4(2_LOAD) U24.4(2_LOAD)
Sense_Hi: J14.2 U25.4(2_LOAD)
Sense_Lo: J14.1 U26.4(2_LOAD)
NetJ4_1: J4.1 R58.1 U5.3(1_LOAD)
NetJ4_2: J4.2 R58.2 U6.3(1_LOAD)
NetJ5_1: J5.1 R59.1 U7.3(1_LOAD)
NetJ5_2: J5.2 R59.2 U8.3(1_LOAD)
NetJ6_1: J6.1 R60.1 U9.3(1_LOAD)
NetJ6_2: J6.2 R60.2 U10.3(1_LOAD)
NetJ7_1: J7.1 R61.1 U11.3(1_LOAD)
NetJ7_2: J7.2 R61.2 U12.3(1_LOAD)
NetJ8_1: J8.1 R62.1 U13.3(1_LOAD)
NetJ8_2: J8.2 R62.2 U14.3(1_LOAD)
NetJ9_1: J9.1 R63.1 U15.3(1_LOAD)
NetJ9_2: J9.2 R63.2 U16.3(1_LOAD)
NetJ10_1: J10.1 R64.1 U17.3(1_LOAD)
NetJ10_2: J10.2 R64.2 U18.3(1_LOAD)
NetJ11_1: J11.1 R65.1 U19.3(1_LOAD)
NetJ11_2: J11.2 R65.2 U20.3(1_LOAD)
NetJ12_1: J12.1 R66.1 U21.3(1_LOAD)
NetJ12_2: J12.2 R66.2 U22.3(1_LOAD)
NetJ13_1: J13.1 R67.1 U23.3(1_LOAD)
NetJ13_2: J13.2 R67.2 U24.3(1_LOAD)
NetJ15_1: J15.1 R68.2 U28.4(2_LOAD)
NetJ15_2: J15.2 R68.1 U27.4(2_LOAD)
NetJ16_1: J16.1 R69.2 U30.4(2_LOAD)
NetJ16_2: J16.2 R69.1 U29.4(2_LOAD)
NetJ17_1: J17.1 R70.2 U32.4(2_LOAD)
NetJ17_2: J17.2 R70.1 U31.4(2_LOAD)
NetJ18_1: J18.1 R71.2 U34.4(2_LOAD)
NetJ18_2: J18.2 R71.1 U33.4(2_LOAD)
NetJ19_1: J19.1 R72.2 U36.4(2_LOAD)
NetJ19_2: J19.2 R72.1 U35.4(2_LOAD)
NetJ20_1: J20.1 R73.2 U38.4(2_LOAD)
NetJ20_2: J20.2 R73.1 U37.4(2_LOAD)
NetJ21_1: J21.1 R74.2 U40.4(2_LOAD)
NetJ21_2: J21.2 R74.1 U39.4(2_LOAD)
NetJ22_1: J22.1 R75.2 U42.4(2_LOAD)
NetJ22_2: J22.2 R75.1 U41.4(2_LOAD)
NetJ23_1: J23.1 R76.2 U44.4(2_LOAD)
NetJ23_2: J23.2 R76.1 U43.4(2_LOAD)
NetJ24_1: J24.1 R77.2 U46.4(2_LOAD)
NetJ24_2: J24.2 R77.1 U45.4(2_LOAD)

### Layout directives
mark named HV: (no net found under the mark), Bus2_Hi, Bus2_Lo, In_Hi, In_Lo, Sense_Hi, Sense_Lo

### Notes on the sheet
- (in symbol TitleBlockStandard) Project:; Page Contents:; Drawn by:; Revision:; Checked by:; Variant:; Sheet; of

### Library data of the parts
J3-J24 = 1733570: single row, 2 pins; Manufacturer: Phoenix Contact; Desctiption: PCB terminal block - SMKDSP 1,5/ 2-5,08; Part Number: 1733570; ComponentLink1Description: Technical drawing; ComponentLink1URL: Datasheets\Connectors\Phoenix Contact\1733570 technical drawing.pdf; Pin Count: 2
R58-R77 = R2512X0.6mm_Generic: Generic ? 1% 2512(6431)x0.6mm 1%; Power: 1W; Package (metric): 6431; Package (imperial): 2512; Part Number: R2512X0.6mm_Generic; Manufacturer: Generic; Height: 0.6mm; Resistance: ?; Accuracy: 1%; Pin Count: 2
TBLOCK?#2 = TitleBlockStandard: Designator: TBLOCK?; Part Number: TitleBlockStandard
U3-U46 = VOR1142B4: Relay Ssr 2MA 1.5V Dc-in 0.14A 400V Dc-out 4-PIN DIP SMD T/r; Manufacturer: Vishay; On-State Resistance: 27R; Current: 140mA; Part Number: VOR1142B4; Voltage: 400V; Package: SOP-4

## Nets that join several sheets
GND: Scan card MCU&Power (34 pins), Scan card SSR (44 pins)
Bus2_In_N: Scan card MCU&Power (R43.2), Scan card SSR (U4.1)
Bus2_In_P: Scan card MCU&Power (R42.2), Scan card SSR (U3.1)
Bus2_Sense_N: Scan card MCU&Power (R45.2), Scan card SSR (U26.1)
Bus2_Sense_P: Scan card MCU&Power (R44.2), Scan card SSR (U25.1)
CH1_N: Scan card MCU&Power (R2.2), Scan card SSR (U14.1)
CH1_P: Scan card MCU&Power (R1.2), Scan card SSR (U13.1)
CH2_N: Scan card MCU&Power (R4.2), Scan card SSR (U12.1)
CH2_P: Scan card MCU&Power (R3.2), Scan card SSR (U11.1)
CH3_N: Scan card MCU&Power (R6.2), Scan card SSR (U10.1)
CH3_P: Scan card MCU&Power (R5.2), Scan card SSR (U9.1)
CH4_N: Scan card MCU&Power (R8.2), Scan card SSR (U8.1)
CH4_P: Scan card MCU&Power (R7.2), Scan card SSR (U7.1)
CH5_N: Scan card MCU&Power (R10.2), Scan card SSR (U6.1)
CH5_P: Scan card MCU&Power (R9.2), Scan card SSR (U5.1)
CH6_N: Scan card MCU&Power (R12.2), Scan card SSR (U24.1)
CH6_P: Scan card MCU&Power (R11.2), Scan card SSR (U23.1)
CH7_N: Scan card MCU&Power (R14.2), Scan card SSR (U22.1)
CH7_P: Scan card MCU&Power (R13.2), Scan card SSR (U21.1)
CH8_N: Scan card MCU&Power (R16.2), Scan card SSR (U20.1)
CH8_P: Scan card MCU&Power (R15.2), Scan card SSR (U19.1)
CH9_N: Scan card MCU&Power (R18.2), Scan card SSR (U18.1)
CH9_P: Scan card MCU&Power (R17.2), Scan card SSR (U17.1)
CH10_N: Scan card MCU&Power (R20.2), Scan card SSR (U16.1)
CH10_P: Scan card MCU&Power (R19.2), Scan card SSR (U15.1)
CH11_N: Scan card MCU&Power (R22.2), Scan card SSR (U36.1)
CH11_P: Scan card MCU&Power (R21.2), Scan card SSR (U35.1)
CH12_N: Scan card MCU&Power (R24.2), Scan card SSR (U34.1)
CH12_P: Scan card MCU&Power (R23.2), Scan card SSR (U33.1)
CH13_N: Scan card MCU&Power (R26.2), Scan card SSR (U32.1)
CH13_P: Scan card MCU&Power (R25.2), Scan card SSR (U31.1)
CH14_N: Scan card MCU&Power (R28.2), Scan card SSR (U30.1)
CH14_P: Scan card MCU&Power (R27.2), Scan card SSR (U29.1)
CH15_N: Scan card MCU&Power (R30.2), Scan card SSR (U28.1)
CH15_P: Scan card MCU&Power (R29.2), Scan card SSR (U27.1)
CH16_N: Scan card MCU&Power (R32.2), Scan card SSR (U46.1)
CH16_P: Scan card MCU&Power (R31.2), Scan card SSR (U45.1)
CH17_N: Scan card MCU&Power (R34.2), Scan card SSR (U44.1)
CH17_P: Scan card MCU&Power (R33.2), Scan card SSR (U43.1)
CH18_N: Scan card MCU&Power (R37.2), Scan card SSR (U42.1)
CH18_P: Scan card MCU&Power (R36.2), Scan card SSR (U41.1)
CH19_N: Scan card MCU&Power (R39.2), Scan card SSR (U40.1)
CH19_P: Scan card MCU&Power (R38.2), Scan card SSR (U39.1)
CH20_N: Scan card MCU&Power (R41.2), Scan card SSR (U38.1)
CH20_P: Scan card MCU&Power (R40.2), Scan card SSR (U37.1)

## Assembly variants
2000-SCAN-20: not fitted R56
2000-SCAN/2001-TCSCAN: not fitted R52; alternate parts U5 -> VOR1142M4, U3 -> VOR1142M4, U4 -> VOR1142M4, U25 -> VOR1142M4, U26 -> VOR1142M4, U14 -> VOR1142M4, U13 -> VOR1142M4, U12 -> VOR1142M4, U11 -> VOR1142M4, U10 -> VOR1142M4, U9 -> VOR1142M4, U8 -> VOR1142M4, U7 -> VOR1142M4, U6 -> VOR1142M4, U15 -> VOR1142M4, U16 -> VOR1142M4, U33 -> VOR1142M4, U45 -> VOR1142M4, U41 -> VOR1142M4, U42 -> VOR1142M4, U43 -> VOR1142M4, U44 -> VOR1142M4, U46 -> VOR1142M4, U32 -> VOR1142M4, U34 -> VOR1142M4, U35 -> VOR1142M4, U36 -> VOR1142M4, U37 -> VOR1142M4, U38 -> VOR1142M4, U39 -> VOR1142M4, U40 -> VOR1142M4, U29 -> VOR1142M4, U31 -> VOR1142M4, U28 -> VOR1142M4, U30 -> VOR1142M4, U27 -> VOR1142M4, U17 -> VOR1142M4, U18 -> VOR1142M4, U19 -> VOR1142M4, U20 -> VOR1142M4, U21 -> VOR1142M4, U22 -> VOR1142M4, U23 -> VOR1142M4, U24 -> VOR1142M4